# EAGLE schematic mcu (EAGLE 9.3.1)
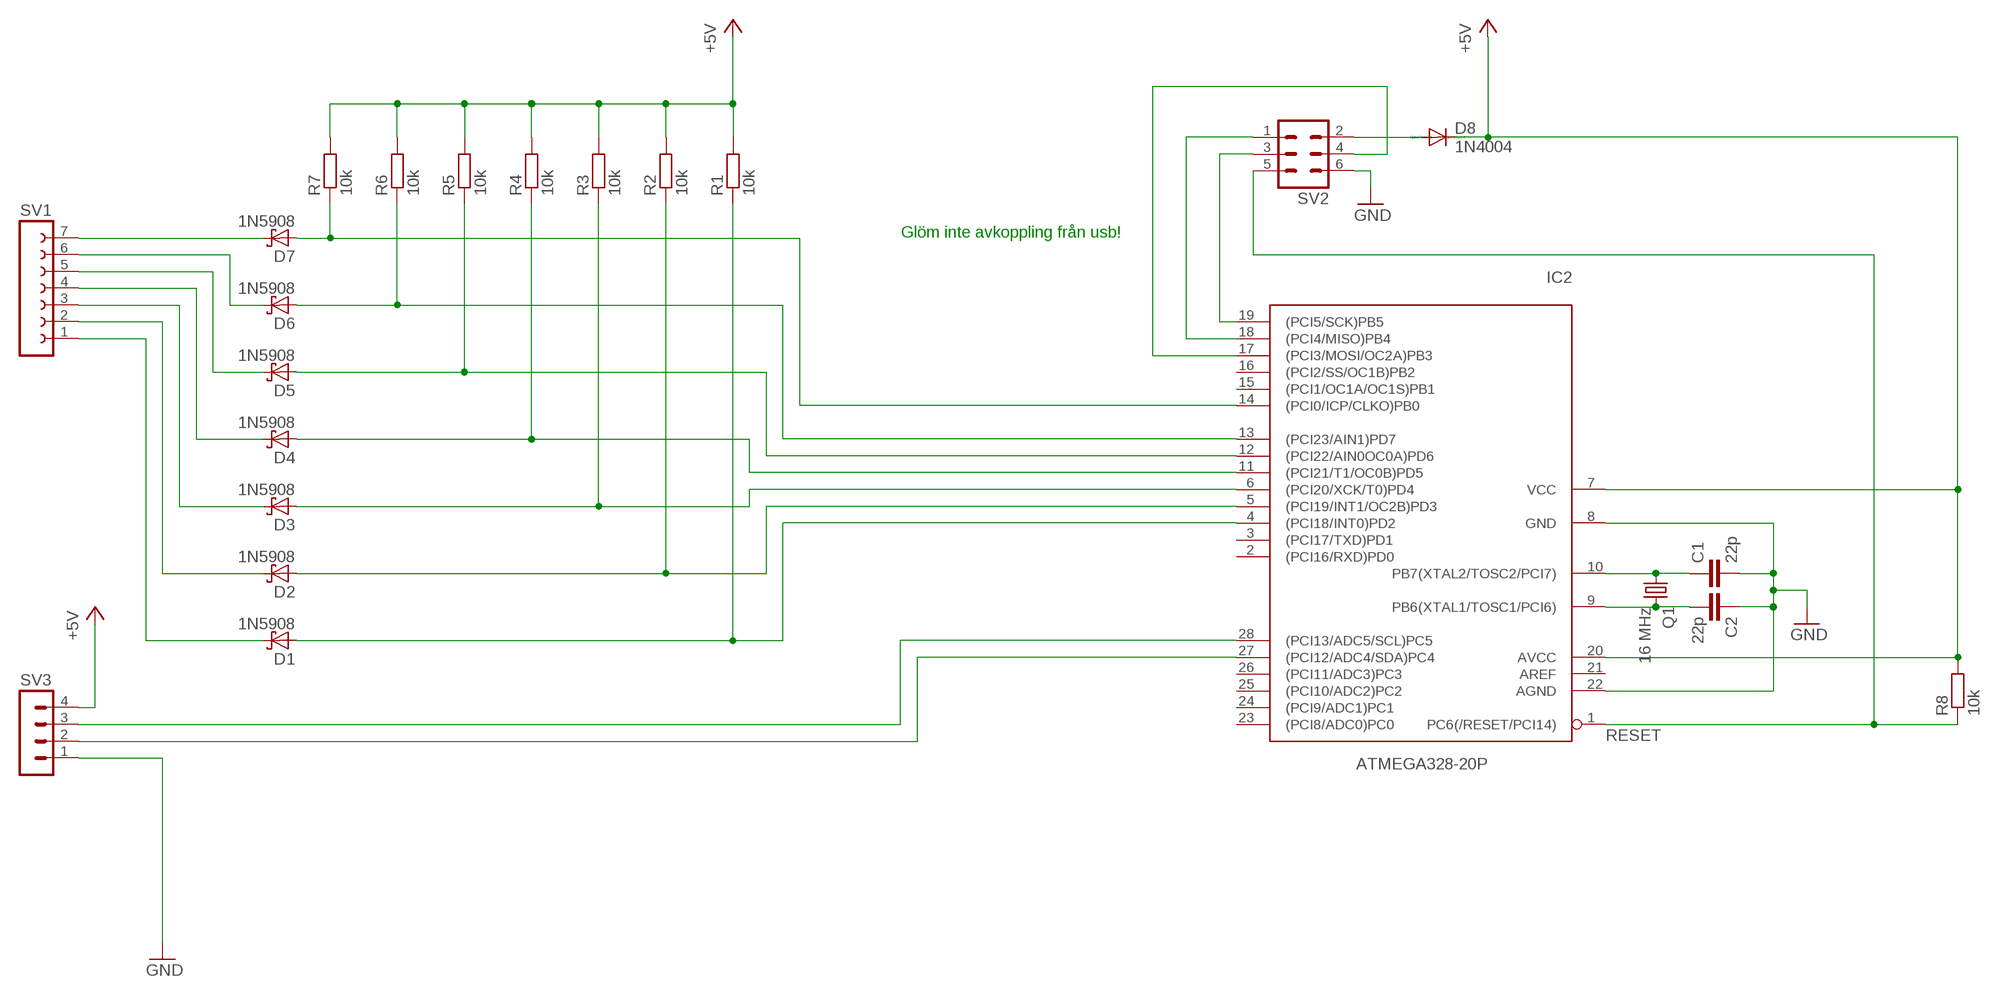
[diagram p0: schematic, sheet 1]

## Parts
C1  22p  C2,5-3  [C2.5-3]
C2  22p  C2,5-3  [C2.5-3]
D1  1N5908  [C4111-15]
D2  1N5908  [C4111-15]
D3  1N5908  [C4111-15]
D4  1N5908  [C4111-15]
D5  1N5908  [C4111-15]
D6  1N5908  [C4111-15]
D7  1N5908  [C4111-15]
D8  1N4004  [DO41-10]
IC2  ATMEGA328-20P  [DIL28-3]
Q1  16 MHz  CRYSTALHC49S  [HC49/S]
R1  10k  R-EU_0207/10  [0207/10]
R2  10k  R-EU_0207/10  [0207/10]
R3  10k  R-EU_0207/10  [0207/10]
R4  10k  R-EU_0207/10  [0207/10]
R5  10k  R-EU_0207/10  [0207/10]
R6  10k  R-EU_0207/10  [0207/10]
R7  10k  R-EU_0207/10  [0207/10]
R8  10k  R-EU_0207/10  [0207/10]
SV1  FE07-1  [FE07]
SV2  MA03-2  [MA03-2]
SV3  MA04-1  [MA04-1]

## Nets
+5V: D8.C IC2.7(VCC) IC2.20(AVCC) R1.2 R2.2 R3.2 R4.2 R5.2 R6.2 R7.2 R8.2 SV3.4
GND: C1.2 C2.1 IC2.8(GND) IC2.22(AGND) SV2.6 SV3.1
N$1: D7.C SV1.7
N$2: D6.C SV1.6
N$3: D5.C SV1.5
N$4: D4.C SV1.4
N$5: D3.C SV1.3
N$6: D2.C SV1.2
N$7: D1.C SV1.1
N$8: D7.A IC2.14((PCI0/ICP/CLKO)PB0) R7.1
N$9: D6.A IC2.13((PCI23/AIN1)PD7) R6.1
N$10: D5.A IC2.12((PCI22/AIN0OC0A)PD6) R5.1
N$11: D4.A IC2.11((PCI21/T1/OC0B)PD5) R4.1
N$12: D3.A IC2.6((PCI20/XCK/T0)PD4) R3.1
N$13: D2.A IC2.5((PCI19/INT1/OC2B)PD3) R2.1
N$14: D1.A IC2.4((PCI18/INT0)PD2) R1.1
N$16: C2.2 IC2.9(PB6(XTAL1/TOSC1/PCI6)) Q1.2
N$17: C1.1 IC2.10(PB7(XTAL2/TOSC2/PCI7)) Q1.1
N$18: IC2.18((PCI4/MISO)PB4) SV2.1
N$19: IC2.19((PCI5/SCK)PB5) SV2.3
N$21: IC2.17((PCI3/MOSI/OC2A)PB3) SV2.4
N$23: IC2.28((PCI13/ADC5/SCL)PC5) SV3.3
N$24: IC2.27((PCI12/ADC4/SDA)PC4) SV3.2
N$25: D8.A SV2.2
RESET: IC2.1(PC6(/RESET/PCI14)) R8.1 SV2.5
Unconnected: IC2.2((PCI16/RXD)PD0) IC2.3((PCI17/TXD)PD1) IC2.15((PCI1/OC1A/OC1S)PB1) IC2.16((PCI2/SS/OC1B)PB2) IC2.21(AREF) IC2.23((PCI8/ADC0)PC0) IC2.24((PCI9/ADC1)PC1) IC2.25((PCI10/ADC2)PC2) IC2.26((PCI11/ADC3)PC3)

## Notes on the sheet
- Glöm inte avkoppling från usb!

## Library data of the parts
C1 C2 = capacitor-wima:C: CAPACITOR naming: grid - package width
D1-D7 = diode:1N5908: DIODE schottky
D8 = diode:1N4004: DIODE general purpose rectifier, 1 A
IC2 = atmega328:ATMEGA328*P: MICROCONTROLLER 32 kBytes FLASH 2 kBytes SRAM 1 kBytes EEPROM USART 8-channel 10 bit ADC
Q1 = crystal:CRYSTAL: CRYSTAL; OC_FARNELL: 1667008; OC_NEWARK: unknown
R1-R8 = rcl:R-EU_: RESISTOR, European symbol
SV1 = con-lsta:FE07-1: FEMALE HEADER; OC_FARNELL: unknown; OC_NEWARK: unknown
SV2 = con-lstb:MA03-2: PIN HEADER; OC_FARNELL: unknown; OC_NEWARK: unknown
SV3 = con-lstb:MA04-1: PIN HEADER; OC_FARNELL: unknown; OC_NEWARK: unknown